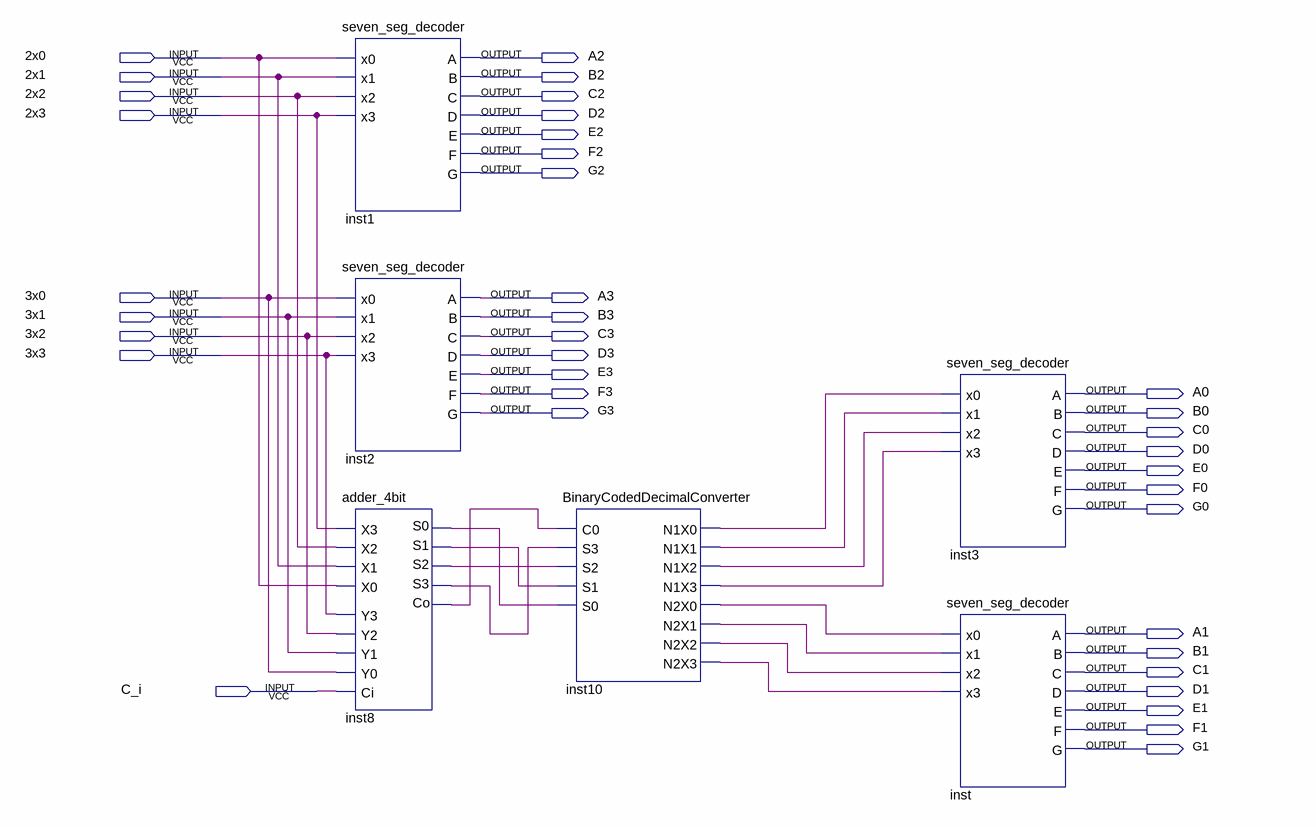
[diagram p0: schematic sheet]
// Quartus schematic lab6.bdf as structural Verilog: 6 symbols, 37 pins
module lab6 (
  input  \2x0 ,
  input  \2x1 ,
  input  \2x2 ,
  input  \2x3 ,
  input  \3x0 ,
  input  \3x1 ,
  input  \3x2 ,
  input  \3x3 ,
  input  C_i,
  output A2,
  output B2,
  output C2,
  output D2,
  output E2,
  output F2,
  output G2,
  output A3,
  output B3,
  output C3,
  output D3,
  output E3,
  output F3,
  output A0,
  output G3,
  output B0,
  output C0,
  output D0,
  output E0,
  output F0,
  output G0,
  output A1,
  output B1,
  output C1,
  output D1,
  output E1,
  output F1,
  output G1
);

  wire inst8_co, inst8_s0, inst8_s1, inst8_s2, inst8_s3, inst10_n1x0, inst10_n1x1, inst10_n1x2, inst10_n1x3,
       inst10_n2x0, inst10_n2x1, inst10_n2x2, inst10_n2x3;

  seven_seg_decoder inst1 (
    .x0(\2x0 ), .x1(\2x1 ), .x2(\2x2 ), .x3(\2x3 ), .A(A2), .B(B2), .C(C2), .D(D2), .E(E2), .F(F2), .G(G2));
  seven_seg_decoder inst2 (
    .x0(\3x0 ), .x1(\3x1 ), .x2(\3x2 ), .x3(\3x3 ), .A(A3), .B(B3), .C(C3), .D(D3), .E(E3), .F(F3), .G(G3));
  adder_4bit inst8 (
    .X3(\2x3 ), .Y3(\3x3 ), .X2(\2x2 ), .Y2(\3x2 ), .X1(\2x1 ), .Y1(\3x1 ), .X0(\2x0 ), .Y0(\3x0 ), .Ci(C_i),
    .S0(inst8_s0), .S1(inst8_s1), .S2(inst8_s2), .S3(inst8_s3), .Co(inst8_co));
  BinaryCodedDecimalConverter inst10 (
    .C0(inst8_co), .S3(inst8_s3), .S2(inst8_s2), .S1(inst8_s1), .S0(inst8_s0), .N1X0(inst10_n1x0),
    .N1X1(inst10_n1x1), .N1X2(inst10_n1x2), .N1X3(inst10_n1x3), .N2X0(inst10_n2x0), .N2X1(inst10_n2x1),
    .N2X2(inst10_n2x2), .N2X3(inst10_n2x3));
  seven_seg_decoder inst3 (
    .x0(inst10_n1x0), .x1(inst10_n1x1), .x2(inst10_n1x2), .x3(inst10_n1x3), .A(A0), .B(B0), .C(C0), .D(D0),
    .E(E0), .F(F0), .G(G0));
  seven_seg_decoder inst (
    .x0(inst10_n2x0), .x1(inst10_n2x1), .x2(inst10_n2x2), .x3(inst10_n2x3), .A(A1), .B(B1), .C(C1), .D(D1),
    .E(E1), .F(F1), .G(G1));
endmodule
